# Altium schematic sheet Active_Electrode.SchDoc
size 381 x 381 mm
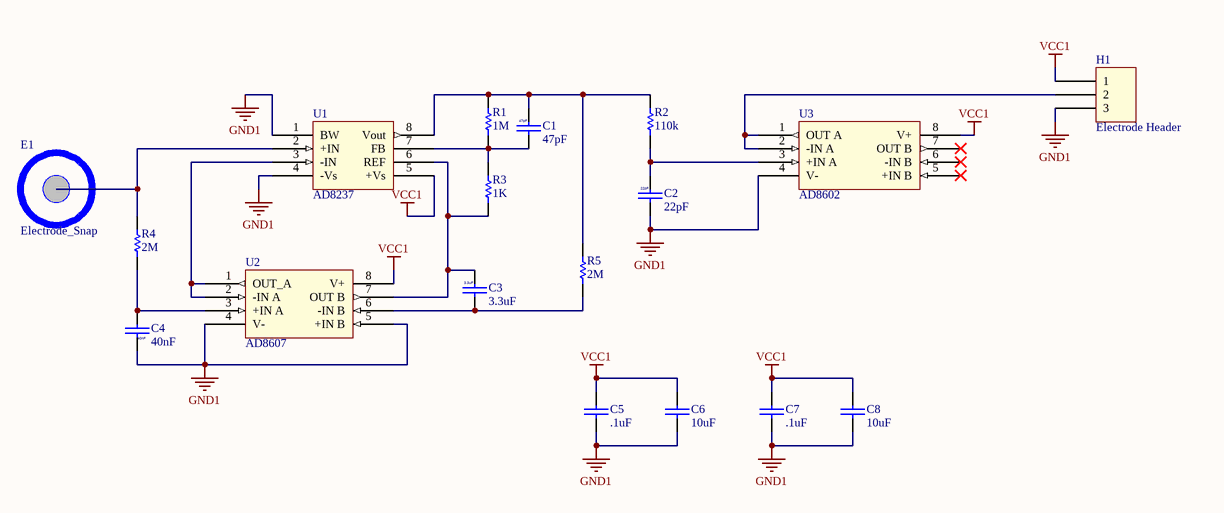
[diagram p0: Active_Electrode.SchDoc]

## Parts
C1  47pF  [0402[IMP]]
C2  22pF  [0402[IMP]]
C3  3.3uF  [0402[IMP]]
C4  40nF  [0402[IMP]]
C5  .1uF  [0402[IMP]]
C6  10uF  [0402[IMP]]
C7  .1uF  [0402[IMP]]
C8  10uF  [0402[IMP]]
E1  Electrode_Snap  [Electrode_Socket]
H1  Electrode Header  [Electrode Header]
R1  1M  [0402[IMP]]
R2  110k  [0402[IMP]]
R3  1K  [0402[IMP]]
R4  2M  [0402[IMP]]
R5  2M  [0402[IMP]]
U1  AD8237  [MSOP-8]
U2  AD8607  [MSOP-8]
U3  AD8602  [MSOP-8]

## Nets
GND1: C2.1 C4.2 C5.1 C6.1 C7.1 C8.1 H1.3 U1.1(BW) U1.4(-Vs) U2.4(V-) U2.5(+IN_B) U3.4(V-)
VCC1: C5.2 C6.2 C7.2 C8.2 H1.1 U1.5(+Vs) U2.8(V+) U3.8(V+)
NetC1_1: C1.1 R1.1 R3.2 U1.7(FB)
NetC1_2: C1.2 R1.2 R2.2 R5.2 U1.8(Vout)
NetC2_2: C2.2 R2.1 U3.3(+IN_A)
NetC3_1: C3.1 R5.1 U2.6(-IN_B)
NetC3_2: C3.2 R3.1 U1.6(REF) U2.7(OUT_B)
NetC4_1: C4.1 R4.1 U2.3(+IN_A)
NetE1_1: E1.1(Signal) R4.2 U1.2(+IN)
NetH1_2: H1.2 U3.1(OUT_A) U3.2(-IN_A)
NetU1_3: U1.3(-IN) U2.1(OUT_A) U2.2(-IN_A)

Not connected (* = marked no-connect by the designer): U3 5(+IN_B)* 6(-IN_B)* 7(OUT_B)*

## Library data of the parts
C1-C8 = CAPACITOR: VOLTAGE: CMAX; CURRENT: CIMAX; KNEE: CBMAX; PSpiceTemplate: C^@REFDES %1 %2 ?TOLERANCE|C^@REFDES| @VALUE ?IC/IC=@IC/ TC=@TC1,@TC2 ?TOLERANCE|\n.model C^@REFDES CAP C=1 DEV=@TOLERANCE%|; DIST: FLAT; SLOPE: CSMAX; MAX_TEMP: CTMAX; TC1: 0; CLASS: DISCRETE; TC2: 0; Supplier 1: Digi-Key
  C1: Value: 47pF
  C2: Value: 22pF; Supplier 2: Digi-Key
  C3: Value: 3.3uF; Supplier 2: Digi-Key
  C4: Value: 40nF
  C5 C7: Value: .1uF; Supplier 2: Digi-Key
  C6 C8: Value: 10uF; Supplier 2: Digi-Key
R1-R5 = RESISTOR: Supplier 1: Digi-Key
  R1: Value: 1M
  R2: Value: 110k
  R3: Value: 1K
  R4 R5: Value: 2M
U1 = AD8237: Supplier 1: Digi-Key; Supplier Part Number 1: AD8237ARMZ-ND
U2 = AD8607: Supplier 1: Digi-Key; Supplier Part Number 1: AD8607ARMZ-R2CT-ND